# Altium schematic sheet Power_Supply.SchDoc
size A3; PageSetup: Record=PageOptions|CenterHorizontal=True|CenterVertical=True|PrintScale=0.73|XCorrection=1.00|YCorrection=1.00|PrintKind=0|BorderSize=5000000|LeftOffset=0|BottomOffset=0|Orientation=2|PaperLength=1000|PaperWidth=1000|Scale=100|PaperSource=7|PrintQuality=-4|MediaType=1|DitherType=10|PaperKind=A4|PrintScaleMode=1; Date: 27.05.2014; DrawnBy: luths8; Organization: BFH; Address1: Bern University of Applied Sciences; Address2: Engineering and Information Technology; Address3: Jlcoweg 1; Address4: CH-3400 Burgdorf; DocumentNumber: 2; Revision: 1.0; SheetNumber: 2; SheetTotal: 16; CurrentDate: 27.05.2014
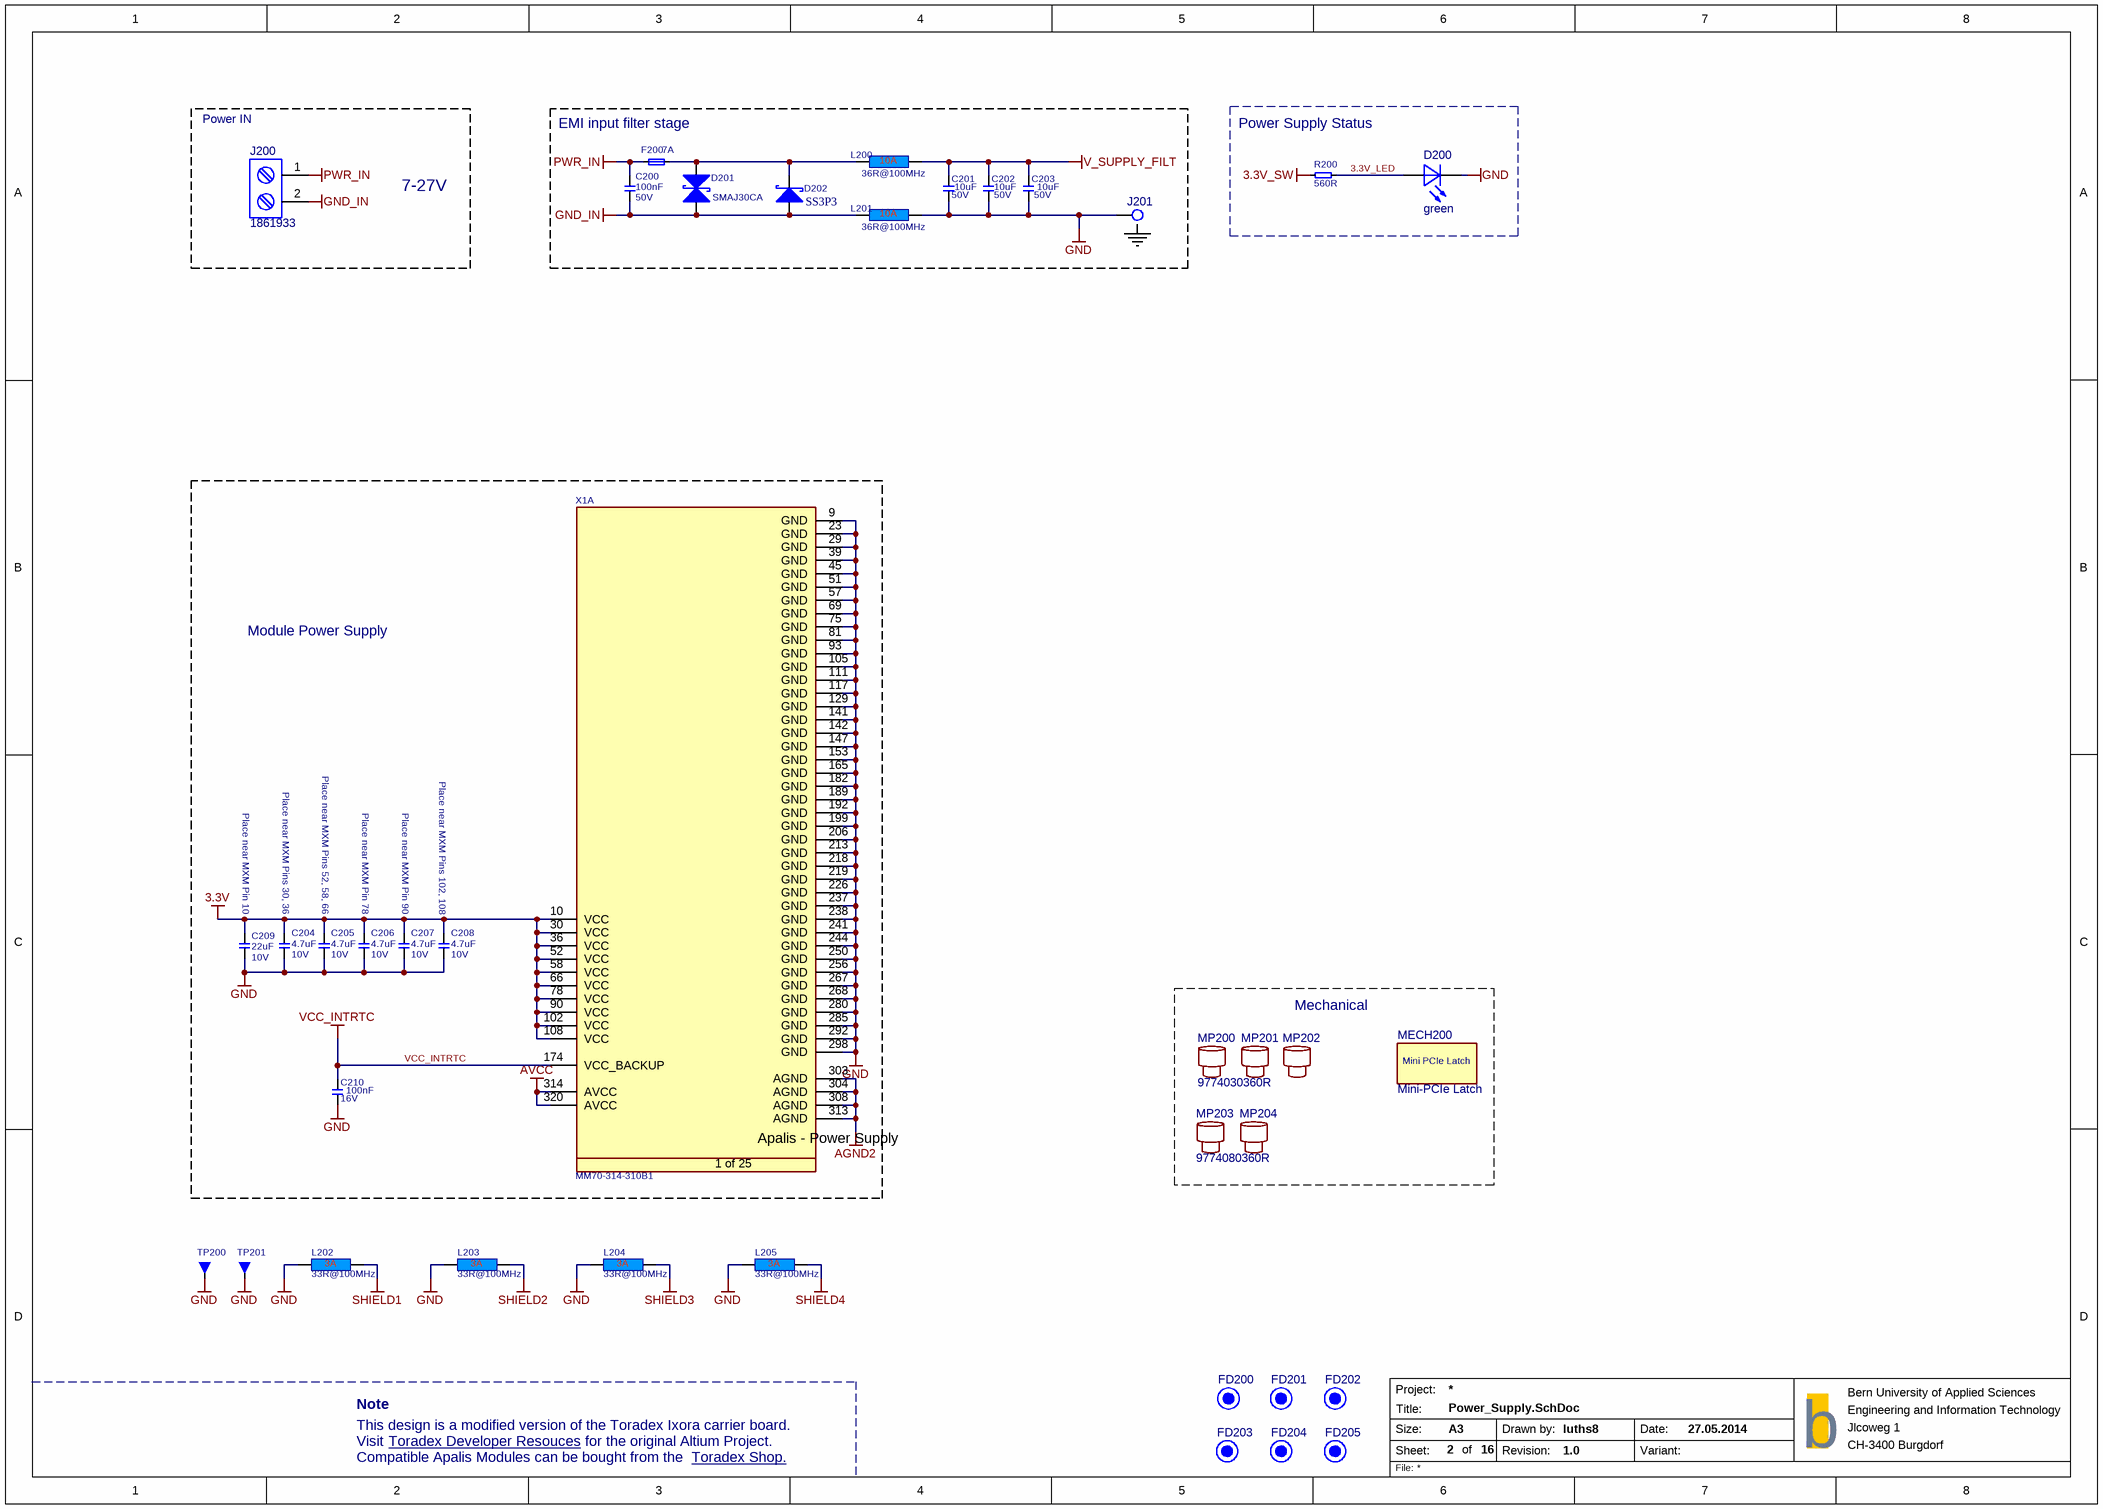
[diagram p0: Power_Supply.SchDoc]

## Parts
C200  Rating: 50V  [SMD0603CAP]  (hidden comment: 100nF)
C201  Rating: 50V  [SMD1210CAP]  (hidden comment: 10uF)
C202  Rating: 50V  [SMD1210CAP]  (hidden comment: 10uF)
C203  Rating: 50V  [SMD1210CAP]  (hidden comment: 10uF)
C204  Rating: 10V  [SMD0603CAP]  (hidden comment: 4.7uF)
C205  Rating: 10V  [SMD0603CAP]  (hidden comment: 4.7uF)
C206  Rating: 10V  [SMD0603CAP]  (hidden comment: 4.7uF)
C207  Rating: 10V  [SMD0603CAP]  (hidden comment: 4.7uF)
C208  Rating: 10V  [SMD0603CAP]  (hidden comment: 4.7uF)
C209  Rating: 10V  [SMD0805CAP]  (hidden comment: 22uF)
C210  Rating: 16V  [SMD0603CAP]  (hidden comment: 100nF)
D200  green  [LED]
D201  Manufacturer Part No.: SMAJ30CA  [T_LITTLEFUSE_SMAJ30CA]  (hidden comment: D-Littelfuse-SMAJ30CA-Schottky)
D202  SS3P3  [T_VISHAY_SS3P3]
F200  7A  [T_Littelfuse_0458]
FD200  Fiducial  [FIDUCIAL]  (value not drawn)  (no BOM)
FD201  Fiducial  [FIDUCIAL]  (value not drawn)  (no BOM)
FD202  Fiducial  [FIDUCIAL]  (value not drawn)  (no BOM)
FD203  Fiducial  [FIDUCIAL]  (value not drawn)  (no BOM)
FD204  Fiducial  [FIDUCIAL]  (value not drawn)  (no BOM)
FD205  Fiducial  [FIDUCIAL]  (value not drawn)  (no BOM)
J200  1861933  [1861933]
J201  Solder Pin  [SOLDER_PIN]  (value not drawn)  (net tie, no BOM)
L200  36R@100MHz  [T_Laird_35F0121-0SR-10]
L201  36R@100MHz  [T_Laird_35F0121-0SR-10]
L202  33R@100MHz  [INDC1608X95N]
L203  33R@100MHz  [INDC1608X95N]
L204  33R@100MHz  [INDC1608X95N]
L205  33R@100MHz  [INDC1608X95N]
MECH200  Mini-PCIe Latch  [T_Molex_48099-5701]
MP200  9774030360R
MP201  9774030360R  (value not drawn)
MP202  9774030360R  (value not drawn)
MP203  9774080360R
MP204  9774080360R  (value not drawn)
R200  560R  [SMD0603RES]
TP200  5011  [T_TP-THT - EYE]  (value not drawn)
TP201  5011  [T_TP-THT - EYE]  (value not drawn)
X1  Manufacturer Part No.: MM70-314-310B1  [T_JAE_MM70-314-310B1]  (hidden comment: CON-JAE-MM70-314-310B1-314-0.5mm)  (part A of 25)

## Blocks framed on the sheet
7-27V: J200
EMI input filter stage: C200-C203 D201 D202 F200 J201 L200 L201
Power Supply Status: D200 R200
Module Power Supply: C204-C210 X1
Mechanical: MECH200 MP200-MP204

## Nets
3.3V: C204.1 C205.1 C206.1 C207.1 C208.1 C209.1 X1.10(VCC) X1.30(VCC) X1.36(VCC) X1.52(VCC) X1.58(VCC) X1.66(VCC) X1.78(VCC) X1.90(VCC) X1.102(VCC) X1.108(VCC)
3.3V_SW: R200.1
AGND2: X1.303(AGND) X1.304(AGND) X1.308(AGND) X1.313(AGND)
AVCC: X1.314(AVCC) X1.320(AVCC)
GND: C201.1 C202.1 C203.1 C204.2 C205.2 C206.2 C207.2 C208.2 C209.2 C210.1 D200.C J201.1 L201.2 L202.1 L203.1 L204.1 L205.1 TP200.1 TP201.1 X1.9(GND) X1.23(GND) X1.29(GND) X1.39(GND) X1.45(GND) X1.51(GND) X1.57(GND) X1.69(GND) X1.75(GND) X1.81(GND) X1.93(GND) X1.105(GND) X1.111(GND) X1.117(GND) X1.129(GND) X1.141(GND) X1.142(GND) X1.147(GND) X1.153(GND) X1.165(GND) X1.182(GND) X1.189(GND) X1.192(GND) X1.199(GND) X1.206(GND) X1.213(GND) X1.218(GND) X1.219(GND) X1.226(GND) X1.237(GND) X1.238(GND) X1.241(GND) X1.244(GND) X1.250(GND) X1.256(GND) X1.267(GND) X1.268(GND) X1.280(GND) X1.285(GND) X1.292(GND) X1.298(GND)
GND_IN: C200.1 D201.2(Anode) D202.2 J200.2 L201.1
PWR_IN: C200.2 F200.1 J200.1
SHIELD1: L202.2
SHIELD2: L203.2
SHIELD3: L204.2
SHIELD4: L205.2
V_SUPPLY_FILT: C201.2 C202.2 C203.2 L200.2
VCC_INTRTC: C210.2 X1.174(VCC_BACKUP)
3.3V_LED: D200.A R200.2
NetD201_1: D201.1(Cathode) D202.1 F200.2 L200.1

## Notes on the sheet
- Power IN
- (near C204) Place near MXM Pins 30, 36
- (near C205) Place near MXM Pins 52, 58, 66
- Place near MXM Pins 102, 108
- Place near MXM Pin 10
- Place near MXM Pin 78
- Place near MXM Pin 90
- Note
- This design is a modified version of the Toradex Ixora carrier board.
- Visit
- Compatible Apalis Modules can be bought from the
- Toradex Developer Resouces <https://developer.toradex.com/products/ixora-carrier-board>
- for the original Altium Project.
- Toradex Shop. <https://www.toradex.com/order-now/apalis-arm-family>
- Project:
- Size:
- Sheet:
- Title:
- A3
- of
- Drawn by:
- Revision:
- Date:
- Variant:
- b
- File:
- (in symbol CON-JAE-MM70-314-310B1-314-0.5mm, part A) Apalis - Power Supply; 1 of 25
- (in symbol MECH-Molex-48099-5701) Mini PCIe Latch

## Library data of the parts
C200 = C-X7R-100nF-50V-20%-0603: Capacitor Ceramic X7R 100nF 50V 20% 0603; Tolerance: 20%; Type: X7R; Value: 100nF
C201-C203 = C-X5R-10uF-50V-20%-1210: Capacitor Ceramic X5R 10uF 50V 20% 1210; Tolerance: 20%; Type: X5R; Value: 10uF
C204-C208 = C-X5R-4.7uF-10V-10%-0603: Capacitor Ceramic X5R 4.7uF 10V 10% 0603; Tolerance: 10%; Type: X5R; Value: 4.7uF
C209 = C-X5R-22uF-10V-20%-0805: Capacitor Ceramic X5R 22uF 10V 20% 0805; Tolerance: 20%; Type: X5R; Value: 22uF
C210 = C-X7R-100nF-16V-10%-0402: Capacitor Ceramic X7R 100nF 16V 10% 0603; Tolerance: 10%; Type: X7R; Value: 100nF
D200 = LED green: Manufacturer Part No.: LGM67KG1J224Z
D201 = D-Littelfuse-SMAJ30CA-Schottky: Bidirectional ESD protection; Manufacturer Name: Littelfuse
D202 = D-Vishay-SS3P3-E3/84A-Schottky: SS3P3-E3/84A Schottky Diode; Manufacturer Name: Vishay; Manufacturer Part No.: SS3P3-E3/84A
F200 = F-Littelfuse-0458007: Fuse 7A Fast; Manufacturer Part No.: 0458007; Manufacturer Name: Littelfuse; Value: 7A
FD200-FD205 = Fiducial: Fiducial Marker
J200 = 1861933: Screw Terminal, 2 Position, 5mm Spacing; System: Connector
L200 L201 = L-Laird-35F0121-0SR-10-10A-25%: Power Supply FB 10A; Tolerance: 25%; Rating: 10A; Value: 36R@100MHz
L202-L205 = L-33R@100MHz-3A-25%-0603: 33R@100MHz 3A EMI FILTER; Tolerance: 25%; Rating: 3A; Value: 33R@100MHz
MECH200 = MECH-Molex-48099-5701: Manufacturer Name: Molex; Manufacturer Part No.: 48099-5701
MP200-MP204 = Spacer M3 SMD
  MP200-MP202: Manufacturer Part No.: 9774030360R
  MP203 MP204: Manufacturer Part No.: 9774080360R
R200 = R-560R-63mW-5%-0402: Resistor 560 ohm 63mW 5% 0603; Rating: 63mW; Tolerance: 5%; Value: 560R
TP200 TP201 = TP-Keystone-5011: Testpin Eye TH; Manufacturere Name: Keystone; Manufacturer Part No.: 5011
X1 = CON-JAE-MM70-314-310B1-314-0.5mm: MXM3 Connector; Manufacturer Name: JAE; No. of ways: 314